# EAGLE schematic minimal (EAGLE 6.6.0)
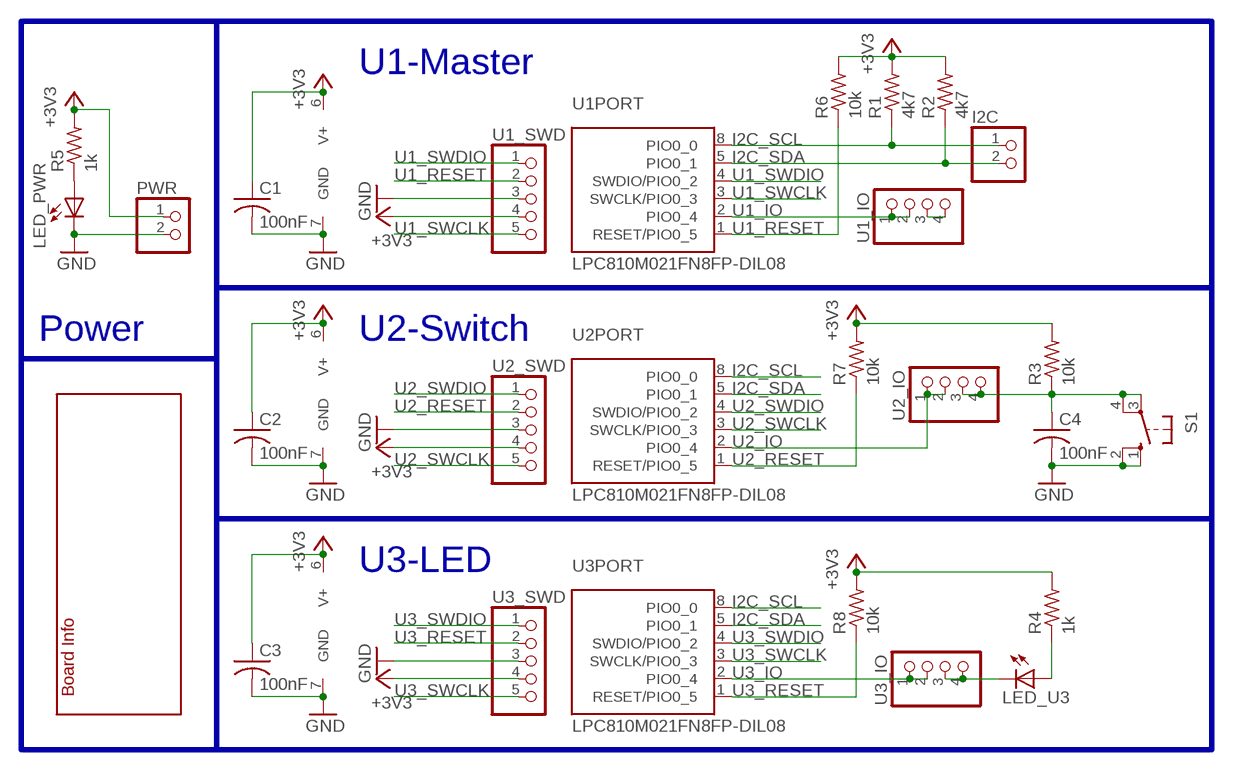
[diagram p0: schematic, sheet 1]

## Parts
C1  100nF  C-US025-025X050  [C025-025X050]
C2  100nF  C-US025-025X050  [C025-025X050]
C3  100nF  C-US025-025X050  [C025-025X050]
C4  100nF  C-US025-025X050  [C025-025X050]
I2C  PINHD-1X2  [1X02]
LED_PWR  LED5MM  [LED5MM]
LED_U3  LED5MM  [LED5MM]
PWR  PINHD-1X2  [1X02]
R1  4k7  R-US_0204/2V  [0204V]
R2  4k7  R-US_0204/2V  [0204V]
R3  10k  R-US_0204/2V  [0204V]
R4  1k  R-US_0204/2V  [0204V]
R5  1k  R-US_0204/2V  [0204V]
R6  10k  R-US_0204/2V  [0204V]
R7  10k  R-US_0204/2V  [0204V]
R8  10k  R-US_0204/2V  [0204V]
S1  10-XX  [B3F-10XX]
U1  LPC810M021FN8FP-DIL08  [DIL08]
U1_IO  PINHD-1X4  [1X04]
U1_SWD  PINHD-1X5  [1X05]
U2  LPC810M021FN8FP-DIL08  [DIL08]
U2_IO  PINHD-1X4  [1X04]
U2_SWD  PINHD-1X5  [1X05]
U3  LPC810M021FN8FP-DIL08  [DIL08]
U3_IO  PINHD-1X4  [1X04]
U3_SWD  PINHD-1X5  [1X05]
U$1  INFO  [INFO]

## Nets
+3V3: C1.1 C2.1 C3.1 PWR.1 R1.2 R2.2 R3.2 R4.2 R5.2 R6.2 R7.2 R8.2 U1.6(PWR:V+) U1_SWD.4 U2.6(PWR:V+) U2_SWD.4 U3.6(PWR:V+) U3_SWD.4
GND: C1.2 C2.2 C3.2 C4.2 LED_PWR.K(C) PWR.2 S1.1(S) S1.2(S1) U1.7(PWR:GND) U1_SWD.3 U2.7(PWR:GND) U2_SWD.3 U3.7(PWR:GND) U3_SWD.3
I2C_SCL: I2C.1 R1.1 U1.8(PORT:PIO0_0) U2.8(PORT:PIO0_0) U3.8(PORT:PIO0_0)
I2C_SDA: I2C.2 R2.1 U1.5(PORT:PIO0_1) U2.5(PORT:PIO0_1) U3.5(PORT:PIO0_1)
N$1: LED_PWR.A R5.1
N$2: C4.1 R3.1 S1.3(P) S1.4(P1) U2_IO.3 U2_IO.4
N$3: U1_IO.3 U1_IO.4
N$4: LED_U3.A R4.1
N$5: LED_U3.K(C) U3_IO.3 U3_IO.4
U1_IO: U1.2(PORT:PIO0_4) U1_IO.1 U1_IO.2
U1_RESET: R6.1 U1.1(PORT:RESET/PIO0_5) U1_SWD.2
U1_SWCLK: U1.3(PORT:SWCLK/PIO0_3) U1_SWD.5
U1_SWDIO: U1.4(PORT:SWDIO/PIO0_2) U1_SWD.1
U2_IO: U2.2(PORT:PIO0_4) U2_IO.1 U2_IO.2
U2_RESET: R7.1 U2.1(PORT:RESET/PIO0_5) U2_SWD.2
U2_SWCLK: U2.3(PORT:SWCLK/PIO0_3) U2_SWD.5
U2_SWDIO: U2.4(PORT:SWDIO/PIO0_2) U2_SWD.1
U3_IO: U3.2(PORT:PIO0_4) U3_IO.1 U3_IO.2
U3_RESET: R8.1 U3.1(PORT:RESET/PIO0_5) U3_SWD.2
U3_SWCLK: U3.3(PORT:SWCLK/PIO0_3) U3_SWD.5
U3_SWDIO: U3.4(PORT:SWDIO/PIO0_2) U3_SWD.1

## Buses
B$1

## Notes on the sheet
- U1-Master
- Power | U2-Switch
- U3-LED

## Library data of the parts
C1-C4 = rcl:C-US: CAPACITOR, American symbol
I2C PWR = pinhead:PINHD-1X2: PIN HEADER
LED_PWR LED_U3 = led:LED: LED OSRAM: - CHIPLED LG R971, LG N971, LY N971, LG Q971, LY Q971, LO R971, LY R971 LH N974, LH R974 LS Q976, LO Q976, LY Q976 LO Q996 - Hyper CHIPLED LW Q18S LB Q993, LB Q99A, LB R99A - SideLED LS A670, LO A670, LY A670, LG A670, LP A670 LB A673, LV A673, LT A673, LW A673 LH A674 LY A675 LS A676, LA A676, LO A676, LY A676, LW A676 LS A679, LY A679, LG A679 - Hyper Micro SIDELED® LS Y876, LA Y876, LO Y876, LY Y876 LT Y87S - SmartLED LW L88C, LW L88S LB L89C, LB L89S, LG L890 LS L89K, LO L89K, LY L89K LS L896, LA L896, LO L896, LY L896 - TOPLED LS T670, LO T670, LY T670, LG T670, LP T670 LSG T670, LSP T670, LSY T670, LOP T670, LYG T670 LG T671, LOG T671, LSG T671 LB T673, LV T673, LT T673, LW T673 LH T674 LS T676, LA T676, LO T676, LY T676, LB T676, LH T676, LSB T676, LW T676 LB T67C, LV T67C, LT T67C, LS T67K, LO T67K, LY T67K, LW E67C LS E67B, LA E67B, LO E67B, LY E67B, LB E67C, LV E67C, LT E67C LW T67C LS T679, LY T679, LG T679 LS T770, LO T770, LY T770, LG T770, LP T770 LB T773, LV T773, LT T773, LW T773 LH T774 LS E675, LA E675, LY E675, LS T675 LS T776, LA T776, LO T776, LY T776, LB T776 LHGB T686 LT T68C, LB T68C - Hyper Mini TOPLED® LB M676 - Mini TOPLED Santana® LG M470 LS M47K, LO M47K, LY M47K Source: http://www.osram.convergy.de LUXEON: - LUMILED® LXK2-PW12-R00, LXK2-PW12-S00, LXK2-PW14-U00, LXK2-PW14-V00 LXK2-PM12-R00, LXK2-PM12-S00, LXK2-PM14-U00 LXK2-PE12-Q00, LXK2-PE12-R00, LXK2-PE12-S00, LXK2-PE14-T00, LXK2-PE14-U00 LXK2-PB12-K00, LXK2-PB12-L00, LXK2-PB12-M00, LXK2-PB14-N00, LXK2-PB14-P00, LXK2-PB14-Q00 LXK2-PR12-L00, LXK2-PR12-M00, LXK2-PR14-Q00, LXK2-PR14-R00 LXK2-PD12-Q00, LXK2-PD12-R00, LXK2-PD12-S00 LXK2-PH12-R00, LXK2-PH12-S00 LXK2-PL12-P00, LXK2-PL12-Q00, LXK2-PL12-R00 Source: www.luxeon.com KINGBRIGHT: KA-3528ASYC Source: www.kingbright.com
R1-R8 = rcl:R-US_: RESISTOR, American symbol
S1 = switch-omron:10-XX: OMRON SWITCH; MPN: B3F-1000; OC_FARNELL: 176432; OC_NEWARK: 36M3542
U1-U3 = modular_robotics:LPC810M021FN8FP
U1_IO U2_IO U3_IO = pinhead:PINHD-1X4: PIN HEADER
U1_SWD U2_SWD U3_SWD = pinhead:PINHD-1X5: PIN HEADER
U$1 = modular_robotics:INFO; AUTHOR: Austin Buchan; DATE: May 29, 2015; DESIGN: MinimalModRob; ORGANIZATION: UC Berkeley ASPIRE; REVISION: r0.0